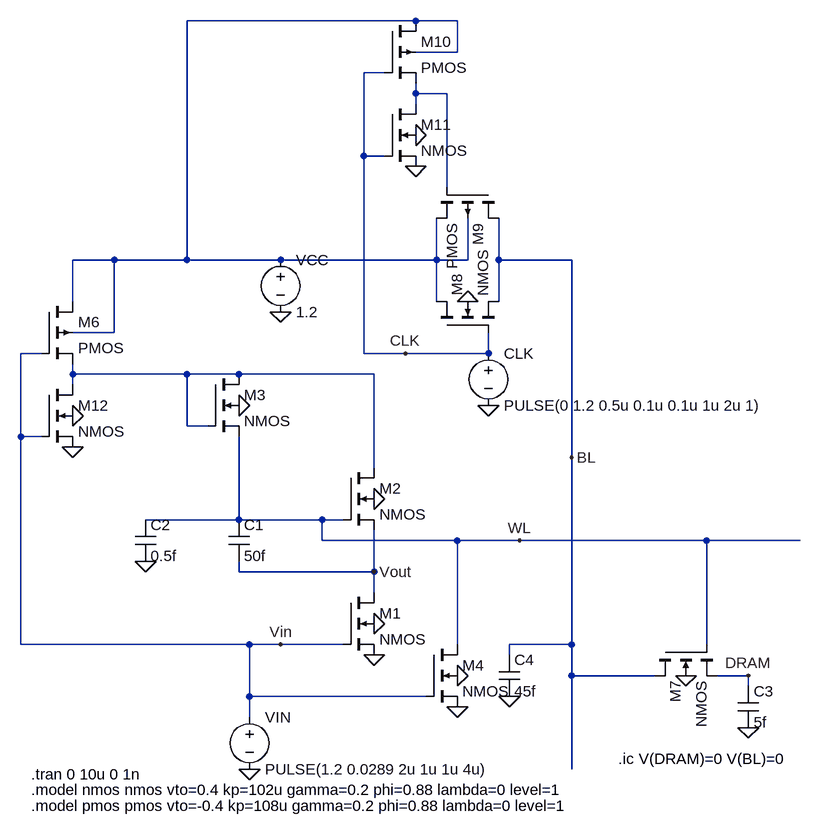
[diagram p0: schematic HW13.asc]
HW13.asc, the LTspice schematic file:
Version 4
SHEET 1 1012 680
WIRE 208 -784 -144 -784
WIRE 272 -784 208 -784
WIRE 272 -736 272 -784
WIRE 272 -736 208 -736
WIRE 160 -704 128 -704
WIRE 208 -672 208 -688
WIRE 256 -672 208 -672
WIRE 208 -656 208 -672
WIRE 128 -576 128 -704
WIRE 160 -576 128 -576
WIRE 256 -528 256 -672
WIRE -256 -416 -320 -416
WIRE -144 -416 -144 -784
WIRE -144 -416 -256 -416
WIRE 0 -416 -144 -416
WIRE 240 -416 240 -480
WIRE 240 -416 0 -416
WIRE 288 -416 288 -480
WIRE 288 -416 240 -416
WIRE 336 -416 336 -480
WIRE 448 -416 336 -416
WIRE -320 -352 -320 -416
WIRE 240 -352 240 -416
WIRE 336 -352 336 -416
WIRE -256 -304 -256 -416
WIRE -256 -304 -320 -304
WIRE -368 -272 -400 -272
WIRE 128 -272 128 -576
WIRE 192 -272 128 -272
WIRE 320 -272 320 -304
WIRE 320 -272 192 -272
WIRE -320 -240 -320 -256
WIRE -144 -240 -320 -240
WIRE -64 -240 -144 -240
WIRE 144 -240 -64 -240
WIRE -320 -224 -320 -240
WIRE -144 -160 -144 -240
WIRE -112 -160 -144 -160
WIRE -400 -144 -400 -272
WIRE -368 -144 -400 -144
WIRE 448 -112 448 -416
WIRE 144 -96 144 -240
WIRE -64 -16 -64 -144
WIRE -64 -16 -208 -16
WIRE 64 -16 -64 -16
WIRE 96 -16 64 -16
WIRE 64 16 64 -16
WIRE 272 16 64 16
WIRE 368 16 272 16
WIRE 656 16 368 16
WIRE 800 16 656 16
WIRE -64 64 -64 48
WIRE 144 64 144 0
WIRE 144 64 -64 64
WIRE 144 96 144 64
WIRE -400 176 -400 -144
WIRE -48 176 -400 176
WIRE 0 176 -48 176
WIRE 96 176 0 176
WIRE 272 176 272 16
WIRE 448 176 448 -112
WIRE 448 176 352 176
WIRE 656 176 656 16
WIRE 352 192 352 176
WIRE 448 224 448 176
WIRE 576 224 448 224
WIRE 720 224 672 224
WIRE 720 240 720 224
WIRE -48 256 -48 176
WIRE 224 256 -48 256
WIRE -48 288 -48 256
WIRE 448 368 448 224
FLAG 144 -48 0
FLAG 144 144 0
FLAG -64 -192 0
FLAG -208 48 0
FLAG 144 192 0
FLAG 0 176 Vin
FLAG 144 64 Vout
FLAG -48 368 0
FLAG 0 -336 0
FLAG 448 -112 BL
FLAG 368 16 WL
FLAG 624 224 0
FLAG 720 304 0
FLAG 352 256 0
FLAG 208 -560 0
FLAG 208 -608 0
FLAG 320 -192 0
FLAG 288 -352 0
FLAG 720 224 DRAM
FLAG 192 -272 CLK
FLAG -320 -128 0
FLAG -320 -176 0
FLAG 272 224 0
FLAG 272 272 0
SYMBOL nmos4 96 96 R0
SYMATTR InstName M1
SYMATTR Value2 l=0.1u w=1u
SYMBOL nmos4 96 -96 R0
SYMATTR InstName M2
SYMATTR Value2 l=0.1u w=0.5u
SYMBOL nmos4 -112 -240 R0
SYMATTR InstName M3
SYMATTR Value2 l=0.1u w=0.5u
SYMBOL cap -80 -16 R0
SYMATTR InstName C1
SYMATTR Value 50f
SYMBOL cap -224 -16 R0
SYMATTR InstName C2
SYMATTR Value 0.5f
SYMBOL voltage -48 272 R0
WINDOW 123 0 0 Left 2
WINDOW 39 0 0 Left 2
SYMATTR InstName VIN
SYMATTR Value PULSE(1.2 0.0289 2u 1u 1u 4u)
SYMBOL voltage 0 -432 R0
SYMATTR InstName VCC
SYMATTR Value 1.2
SYMBOL nmos4 576 176 M90
SYMATTR InstName M7
SYMATTR Value2 l=1u w=1u
SYMBOL cap 704 240 R0
SYMATTR InstName C3
SYMATTR Value 5f
SYMBOL cap 336 192 R0
SYMATTR InstName C4
SYMATTR Value 45f
SYMBOL nmos4 240 -304 R270
SYMATTR InstName M8
SYMATTR Value2 l=0.1u w=0.1u
SYMBOL pmos4 336 -528 R90
SYMATTR InstName M9
SYMATTR Value2 l=0.1u w=0.1u
SYMBOL pmos4 160 -784 R0
SYMATTR InstName M10
SYMATTR Value2 l=0.1u w=0.1u
SYMBOL nmos4 160 -656 R0
SYMATTR InstName M11
SYMATTR Value2 l=0.1u w=0.1u
SYMBOL voltage 320 -288 R0
WINDOW 123 0 0 Left 2
WINDOW 39 0 0 Left 2
SYMATTR InstName CLK
SYMATTR Value PULSE(0 1.2 0.5u 0.1u 0.1u 1u 2u 1)
SYMBOL pmos4 -368 -352 R0
SYMATTR InstName M6
SYMATTR Value2 l=0.1u w=0.1u
SYMBOL nmos4 -368 -224 R0
SYMATTR InstName M12
SYMATTR Value2 l=0.1u w=0.1u
SYMBOL nmos4 224 176 R0
SYMATTR InstName M4
SYMATTR Value2 l=1u w=0.01u
TEXT -384 400 Left 2 !.model nmos nmos vto=0.4 kp=102u gamma=0.2 phi=0.88 lambda=0 level=1
TEXT -384 376 Left 2 !.tran 0 10u 0 1n
TEXT -384 424 Left 2 !.model pmos pmos vto=-0.4 kp=108u gamma=0.2 phi=0.88 lambda=0 level=1
TEXT 520 352 Left 2 !.ic V(DRAM)=0 V(BL)=0

The netlist it stands for:
* HW13.asc
M1 Vout Vin 0 0 NMOS l=0.1u w=1u
M2 N003 WL Vout 0 NMOS l=0.1u w=0.5u
M3 N003 N003 WL 0 NMOS l=0.1u w=0.5u
C1 WL Vout 50f
C2 WL 0 0.5f
VIN Vin 0 PULSE(1.2 0.0289 2u 1u 1u 4u)
VCC N001 0 1.2
M7 BL WL DRAM 0 NMOS l=1u w=1u
C3 DRAM 0 5f
C4 BL 0 45f
M8 N001 CLK BL 0 NMOS l=0.1u w=0.1u
M9 BL N002 N001 N001 PMOS l=0.1u w=0.1u
M10 N001 CLK N002 N001 PMOS l=0.1u w=0.1u
M11 N002 CLK 0 0 NMOS l=0.1u w=0.1u
V§CLK CLK 0 PULSE(0 1.2 0.5u 0.1u 0.1u 1u 2u 1)
M6 N001 Vin N003 N001 PMOS l=0.1u w=0.1u
M12 N003 Vin 0 0 NMOS l=0.1u w=0.1u
M4 WL Vin 0 0 NMOS l=1u w=0.01u
.model NMOS NMOS
.model PMOS PMOS
.lib standard.mos
.model nmos nmos vto=0.4 kp=102u gamma=0.2 phi=0.88 lambda=0 level=1
.tran 0 10u 0 1n
.model pmos pmos vto=-0.4 kp=108u gamma=0.2 phi=0.88 lambda=0 level=1
.ic V(DRAM)=0 V(BL)=0
.backanno
.end